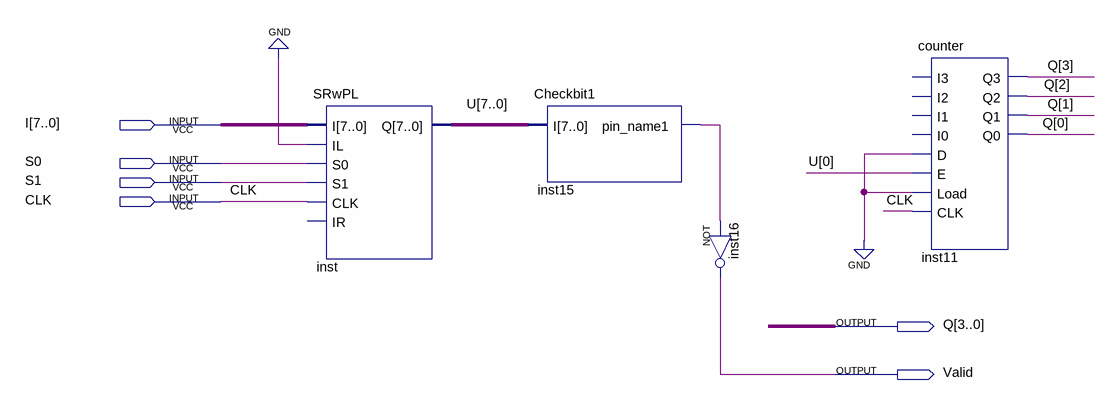
[diagram p0: schematic sheet]
// Quartus schematic counterbit1.bdf as structural Verilog: 4 symbols, 6 pins
module counterbit1 (
  input  [7:0] I,
  input  S0,
  input  S1,
  input  CLK,
  output [3:0] Q,
  output Valid
);

  wire inst15_pin_name1;
  wire [7:0] U;

  SRwPL inst (.I(I), .IL(1'b0), .S0(S0), .S1(S1), .CLK(CLK), .Q(U));  // open: IR
  Checkbit1 inst15 (.I(U), .pin_name1(inst15_pin_name1));
  not inst16 (Valid, inst15_pin_name1);
  counter inst11 (
    .D(1'b0), .E(U[0]), .Load(1'b0), .CLK(CLK), .Q3(Q[3]), .Q2(Q[2]), .Q1(Q[1]), .Q0(Q[0]));  // open: I3, I2, I1, I0
endmodule
